# EAGLE schematic record (EAGLE 6.6.0)
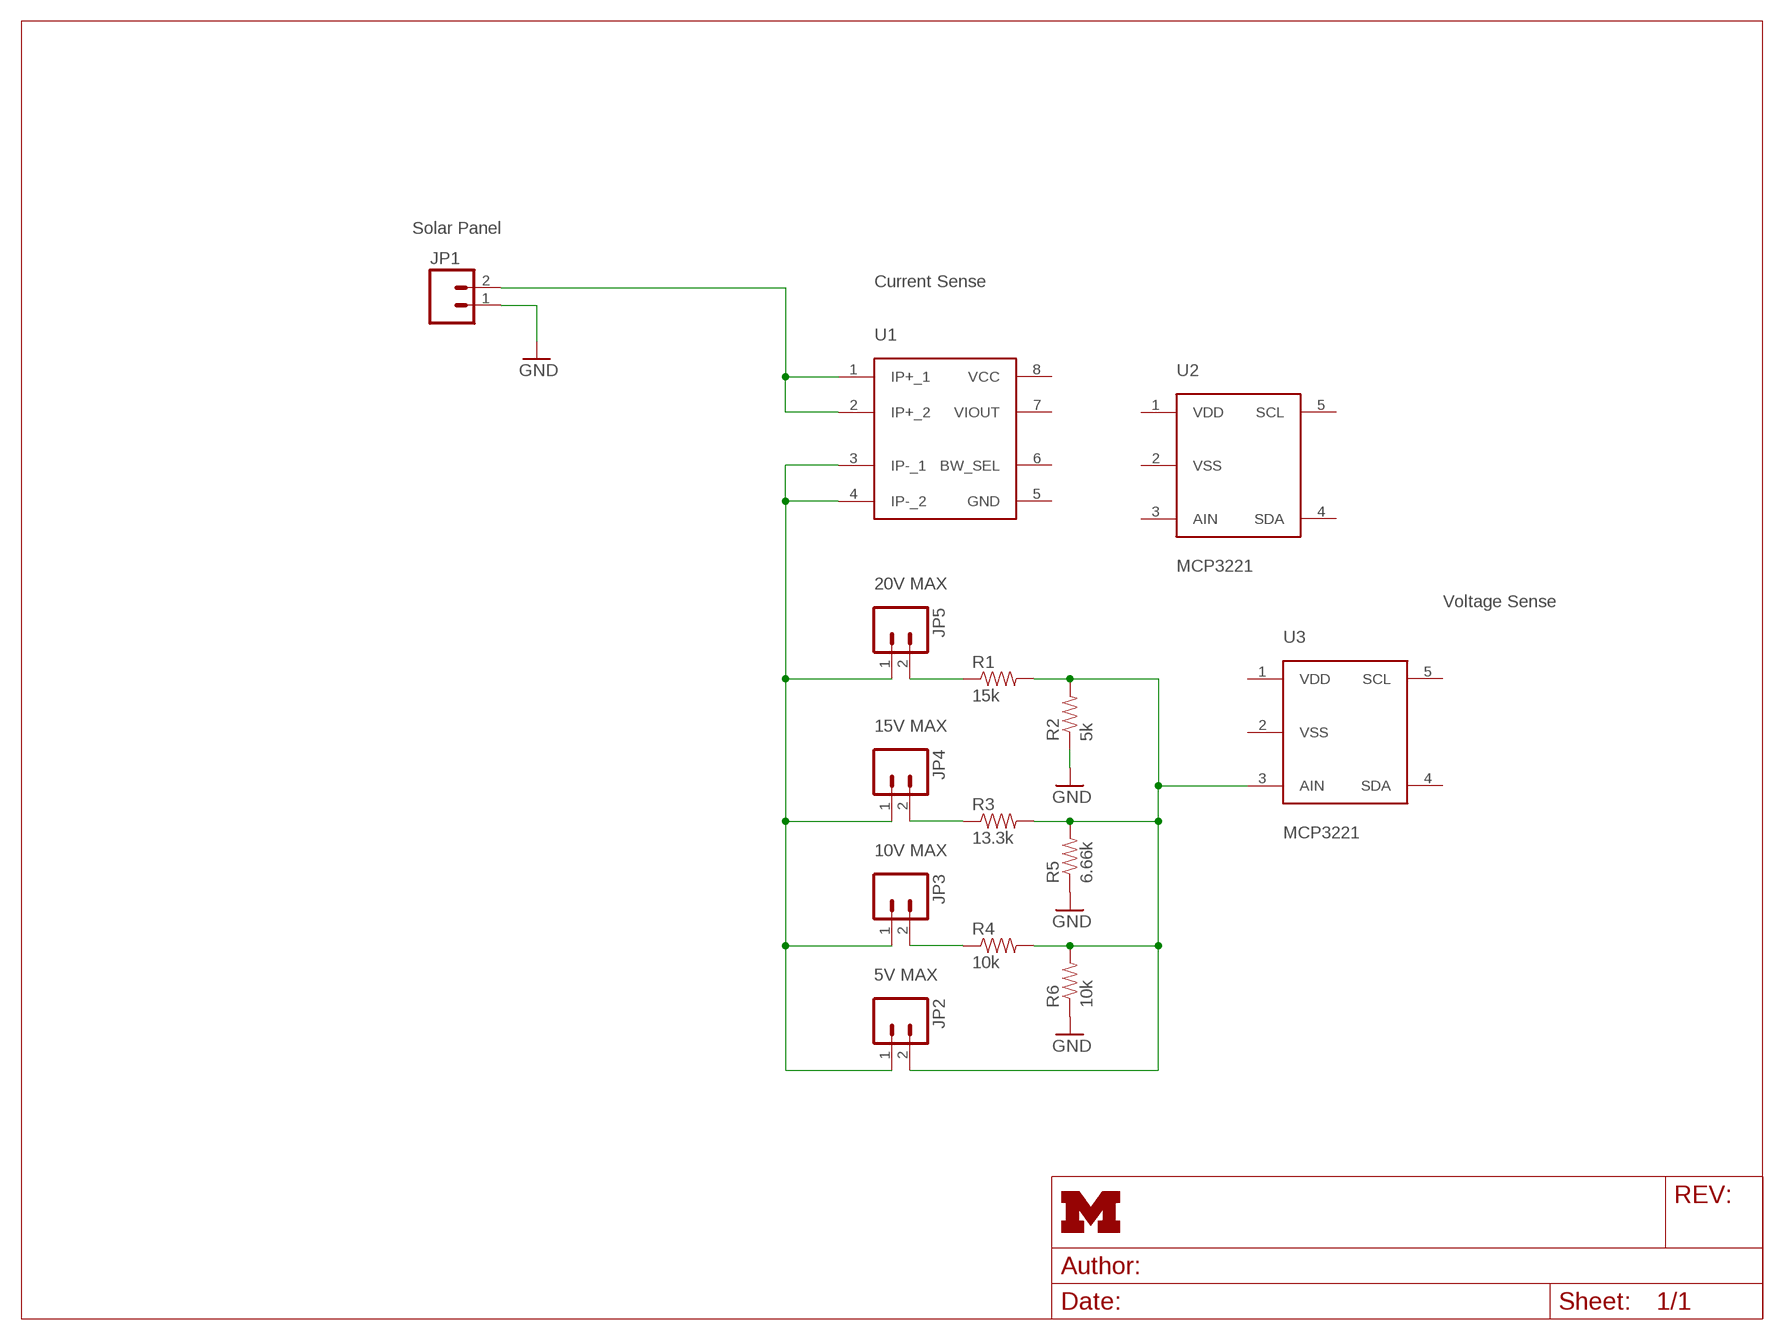
[diagram p0: schematic, sheet 1]
FRAME1 (LETTER_L): HEIGHT: 8.5in; WIDTH: 11in

## Parts
JP1  M02PTH  [1X02]
JP2  M02PTH  [1X02]
JP3  M02PTH  [1X02]
JP4  M02PTH  [1X02]
JP5  M02PTH  [1X02]
R1  15k  RESISTOR0603-RES  [0603-RES]
R2  5k  RESISTOR0603-RES  [0603-RES]
R3  13.3k  RESISTOR0603-RES  [0603-RES]
R4  10k  RESISTOR0603-RES  [0603-RES]
R5  6.66k  RESISTOR0603-RES  [0603-RES]
R6  10k  RESISTOR0603-RES  [0603-RES]
U1  ACS723  [SOIC-8]
U2  MCP3221  [SOT-23-5]
U3  MCP3221  [SOT-23-5]

## Nets
GND: JP1.1 R2.1 R5.1 R6.1
N$1: JP1.2 U1.1(IP+_1) U1.2(IP+_2)
N$2: JP2.1 JP3.1 JP4.1 JP5.1 U1.3(IP-_1) U1.4(IP-_2)
N$3: JP5.2 R1.1
N$4: JP2.2 R1.2 R2.2 R3.2 R4.2 R5.2 R6.2 U3.3(AIN)
N$8: JP4.2 R3.1
N$9: JP3.2 R4.1
Unconnected: U1.5(GND) U1.6(BW_SEL) U1.7(VIOUT) U1.8(VCC) U2.1(VDD) U2.2(VSS) U2.3(AIN) U2.4(SDA) U2.5(SCL) U3.1(VDD) U3.2(VSS) U3.4(SDA) U3.5(SCL)

## Notes on the sheet
- Solar Panel
- Current Sense
- 20V MAX
- Voltage Sense
- 15V MAX
- 10V MAX
- 5V MAX

## Library data of the parts
JP1-JP5 = SparkFun-Connectors:M02: Header 2 Standard 2-pin 0.1" header. Use with straight break away headers (SKU : PRT-00116), right angle break away headers (PRT-00553), swiss pins (PRT-00743), machine pins (PRT-00117), and female headers (PRT-00115). Molex polarized connector foot print use with SKU : PRT-08233 with associated crimp pins and housings.
R1-R6 = SparkFun-Passives:RESISTOR: Resistor Basic schematic elements and footprints for 0603, 1206, and PTH resistors.
U1 = chips:ACS723: Allegro Micro hall affect current sensor; DIGIKEY: 620-1641-1-ND
U2 U3 = chips:MCP3221: A very simple I2C 12 bit ADC; DIGIKEY: MCP3221A5T-I/OTCT-ND